# EAGLE design w076o (EAGLE 6.6.0)
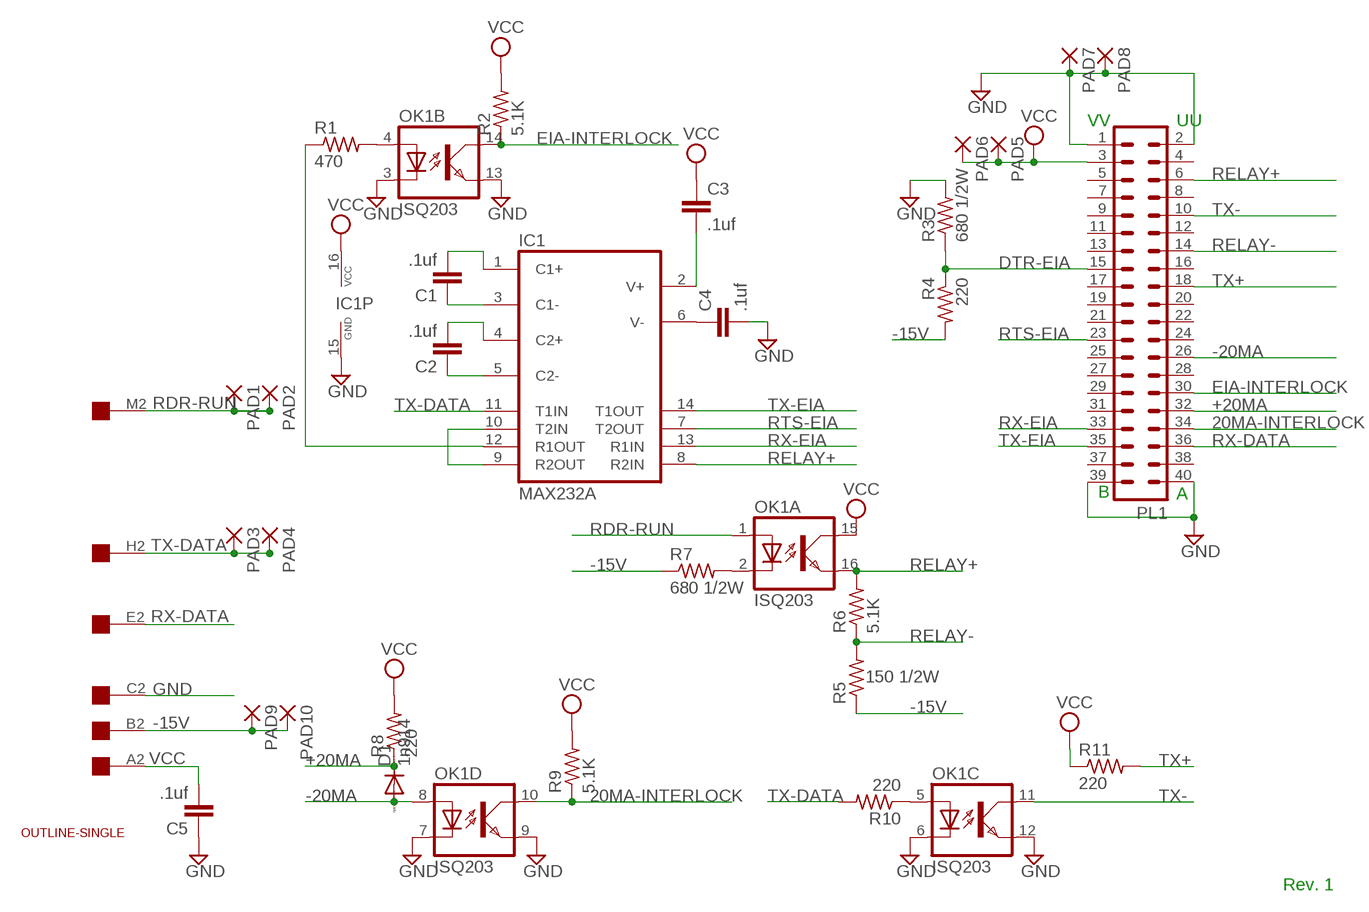
[diagram p0: schematic, sheet 1]

## Parts
C1  .1uf  C-EU050-025X075  [C050-025X075]
C2  .1uf  C-EU050-025X075  [C050-025X075]
C3  .1uf  C-EU050-025X075  [C050-025X075]
C4  .1uf  C-EU050-025X075  [C050-025X075]
C5  .1uf  C-EU050-025X075  [C050-025X075]
D1  1n914  1N4004  [DO41-10]
IC1  MAX232A  MAX232  [DIL16]
OK1  ISQ203  ILQ1  [DIL16]
PAD1  1,6/0,8  [1,6/0,8]
PAD2  1,6/0,8  [1,6/0,8]
PAD3  1,6/0,8  [1,6/0,8]
PAD4  1,6/0,8  [1,6/0,8]
PAD5  1,6/0,8  [1,6/0,8]
PAD6  1,6/0,8  [1,6/0,8]
PAD7  1,6/0,8  [1,6/0,8]
PAD8  1,6/0,8  [1,6/0,8]
PAD9  1,6/0,8  [1,6/0,8]
PAD10  1,6/0,8  [1,6/0,8]
PL1  40H  [40H]
R1  470  R-US_0207/10  [0207/10]
R2  5.1K  R-US_0207/10  [0207/10]
R3  680 1/2W  R-US_0207/12  [0207/12]
R4  220  R-US_0207/10  [0207/10]
R5  150 1/2W  R-US_0207/12  [0207/12]
R6  5.1K  R-US_0207/10  [0207/10]
R7  680 1/2W  R-US_0207/12  [0207/12]
R8  220  R-US_0207/10  [0207/10]
R9  5.1K  R-US_0207/10  [0207/10]
R10  220  R-US_0207/10  [0207/10]
R11  220  R-US_0207/10  [0207/10]
U$1  EDGE-2CONNECTOR  [EDGE-CON2]
U$2  OUTLINE-SINGLE  [SINGLE]

## Nets
20MA-INTERLOCK: OK1.10(D:COL) PL1.34 R9.1
+20MA: D1.C PL1.32 R8.1
-15V [supply]: PAD9.1(P) PAD10.1(P) R4.2 R5.1 R7.1 U$1.B2
-20MA: D1.A OK1.8(D:A) PL1.26
DTR-EIA: PL1.15 R3.1 R4.1
EIA-INTERLOCK: OK1.14(B:COL) PL1.30 R2.1
GND [supply]: C4.2 C5.1 IC1.15(GND) OK1.3(B:C) OK1.6(C:C) OK1.7(D:C) OK1.9(D:EMIT) OK1.12(C:EMIT) OK1.13(B:EMIT) PAD7.1(P) PAD8.1(P) PL1.1 PL1.2 PL1.39 PL1.40 R3.2 U$1.C2
N$1: C2.1 IC1.5(C2-)
N$2: C2.2 IC1.4(C2+)
N$3: C1.2 IC1.1(C1+)
N$4: C1.1 IC1.3(C1-)
N$5: OK1.2(A:C) R7.2
N$6: IC1.9(R2OUT) IC1.10(T2IN)
N$8: IC1.12(R1OUT) R1.1
N$9: C3.2 IC1.2(V+)
N$10: C4.1 IC1.6(V-)
N$11: OK1.4(B:A) R1.2
N$15: OK1.5(C:A) R10.1
RDR-RUN: OK1.1(A:A) PAD1.1(P) PAD2.1(P) U$1.M2
RELAY+: IC1.8(R2IN) OK1.16(A:EMIT) PL1.6 R6.2
RELAY-: PL1.14 R5.2 R6.1
RTS-EIA: IC1.7(T2OUT) PL1.23
RX-DATA: PL1.36 U$1.E2
RX-EIA: IC1.13(R1IN) PL1.33
TX+: PL1.18 R11.2
TX-: OK1.11(C:COL) PL1.10
TX-DATA: IC1.11(T1IN) PAD3.1(P) PAD4.1(P) R10.2 U$1.H2
TX-EIA: IC1.14(T1OUT) PL1.35
VCC [supply]: C3.1 C5.2 IC1.16(VCC) OK1.15(A:COL) PAD5.1(P) PAD6.1(P) PL1.3 R2.2 R8.2 R9.2 R11.1 U$1.A2
Unconnected: PL1.4 PL1.5 PL1.7 PL1.8 PL1.9 PL1.11 PL1.12 PL1.13 PL1.16 PL1.17 PL1.19 PL1.20 PL1.21 PL1.22 PL1.24 PL1.25 PL1.27 PL1.28 PL1.29 PL1.31 PL1.37 PL1.38 U$1.A1 U$1.B1 U$1.C1 U$1.D1 U$1.D2 U$1.E1 U$1.F1 U$1.F2 U$1.H1 U$1.J1 U$1.J2 U$1.K1 U$1.K2 U$1.L1 U$1.L2 U$1.M1 U$1.N1 U$1.N2 U$1.P1 U$1.P2 U$1.R1 U$1.R2 U$1.S1 U$1.S2 U$1.T1 U$1.T2 U$1.U1 U$1.U2 U$1.V1 U$1.V2

## Notes on the sheet
- VV | UU
- B | A
- Rev. 1

## Library data of the parts
C1-C5 = rcl:C-EU: CAPACITOR, European symbol
D1 = diode:1N4004: DIODE general purpose rectifier, 1 A
IC1 = maxim:MAX232: RS232 TRANSCEIVER; MF: MAXIM; MPN: MAX232ACPE+; OC_FARNELL: 9723773; OC_NEWARK: 68K4544
OK1 = optocoupler:ILQ1: SIEMENS OPTO COUPLER; MF: VISHAY/TELEFUNKEN; MPN: ILQ1; OC_FARNELL: 1469501; OC_NEWARK: 88K1954
PAD1-PAD10 = wirepad:1,6/0,8: THROUGH-HOLE PAD
PL1 = con-harting-h:40H: CONNECTOR; OC_FARNELL: unknown; OC_NEWARK: unknown
R1-R11 = rcl:R-US_: RESISTOR, American symbol
U$1 = dec-con:EDGE-2: Double-Sided DEC edge connector.
U$2 = dec-con:OUTLINE-*: Board outlines for DEC boards.

## Net classes
1 supply: width 0.508 mm

## Board
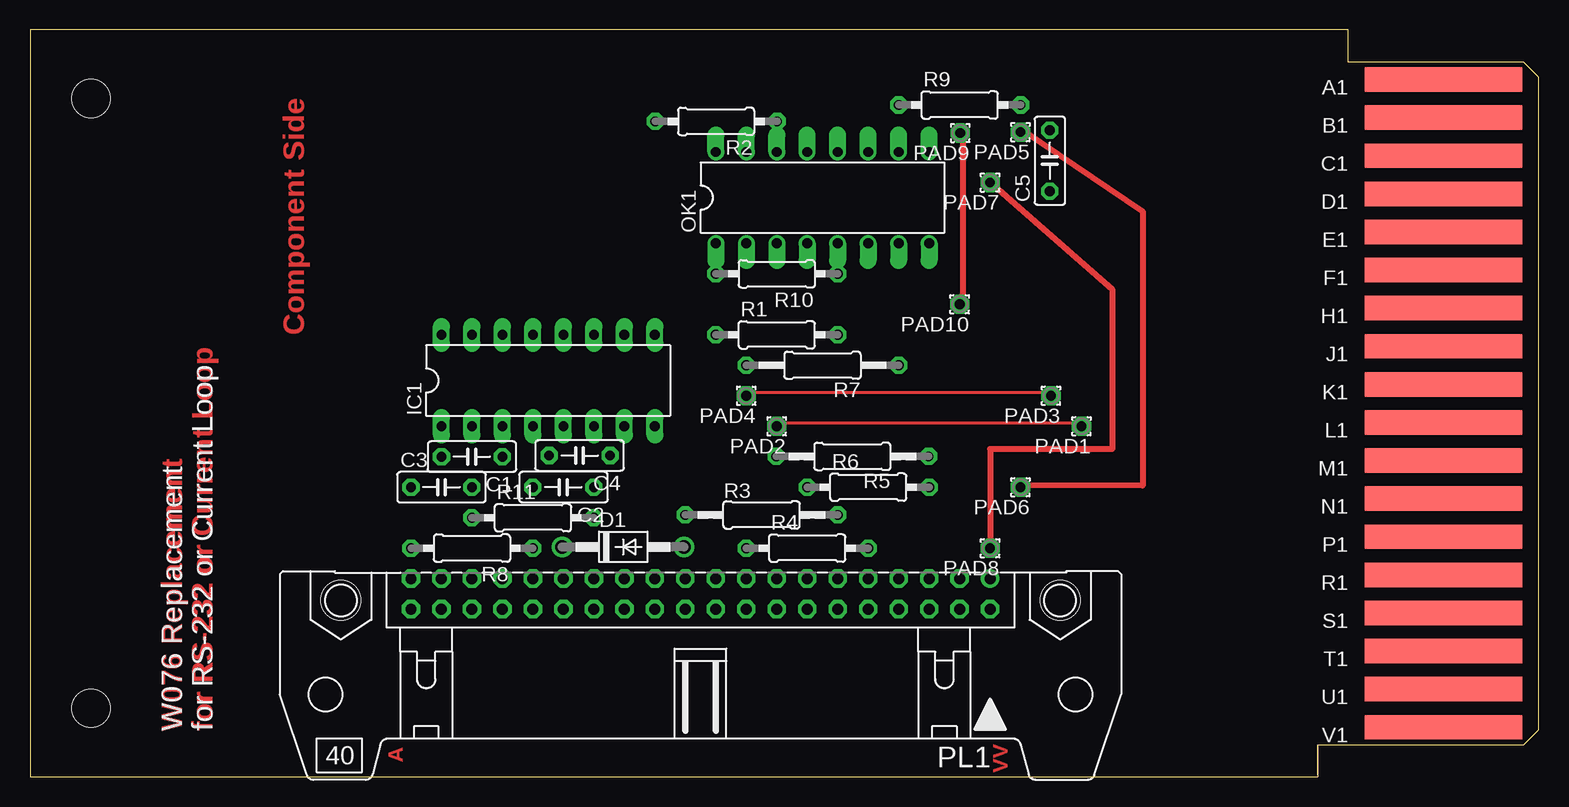
[diagram p1: board, top side]
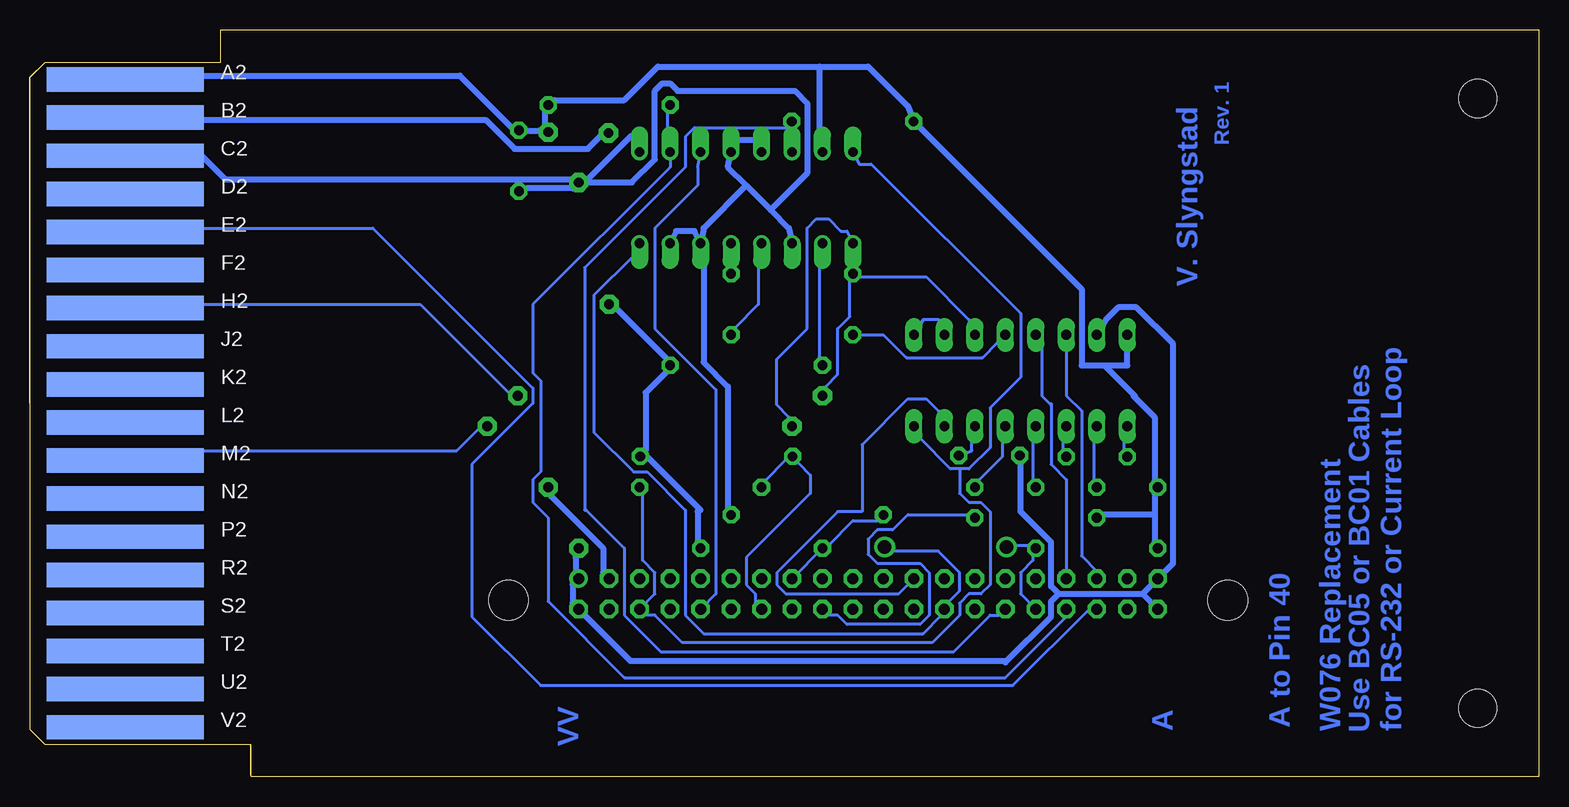
[diagram p2: board, bottom side, seen from below]

Size 125.73 x 62.23 mm. Coordinates in mm from the lower left corner, seen from the top.
Copper layers (1*16): Top 0.035mm / dielectric 1.5mm / Bottom 0.035mm
Design rules "10mils *": minimum track width 10mil, minimum drill 28mil, track to track 15mil, track to pad 10mil, pad to pad 10mil, via to via 10mil, smd to smd 10mil, copper to edge 15mil, drill to drill 10mil, minimum pad ring 12mil, minimum via ring 8mil, stop-mask expansion 0mil, vias tented up to drill 0mil, thermal gap 10mil

### Footprints (pad centres in the part's own frame; a part is rotated, then mirrored left to right if it is on the bottom)
C050-025X075 = drill 0.813 octagon: 1 -2.54,0; 2 2.54,0
DO41-10 = drill 1.118: A 5.08,0; C -5.08,0
DIL16 = drill 0.813 long: 1 -8.89,-3.81; 2 -6.35,-3.81; 3 -3.81,-3.81; 4 -1.27,-3.81; 5 1.27,-3.81; 6 3.81,-3.81; 7 6.35,-3.81; 8 8.89,-3.81; 9 8.89,3.81; 10 6.35,3.81; 11 3.81,3.81; 12 1.27,3.81; 13 -1.27,3.81; 14 -3.81,3.81; 15 -6.35,3.81; 16 -8.89,3.81
DIL16' = drill 0.813 offset: 1 -8.89,-3.81; 2 -6.35,-3.81; 3 -3.81,-3.81; 4 -1.27,-3.81; 5 1.27,-3.81; 6 3.81,-3.81; 7 6.35,-3.81; 8 8.89,-3.81; 9 8.89,3.81; 10 6.35,3.81; 11 3.81,3.81; 12 1.27,3.81; 13 -1.27,3.81; 14 -3.81,3.81; 15 -6.35,3.81; 16 -8.89,3.81
1,6/0,8 = drill 0.813 pad 1.6 octagon: 1 0,0
40H = drill 0.914: 1 -24.13,-1.27 | drill 0.914 octagon: 2 -24.13,1.27; 3 -21.59,-1.27; 4 -21.59,1.27; 5 -19.05,-1.27; 6 -19.05,1.27; 7 -16.51,-1.27; 8 -16.51,1.27; 9 -13.97,-1.27; 10 -13.97,1.27; 11 -11.43,-1.27; 12 -11.43,1.27; 13 -8.89,-1.27; 14 -8.89,1.27; 15 -6.35,-1.27; 16 -6.35,1.27; 17 -3.81,-1.27; 18 -3.81,1.27; 19 -1.27,-1.27; 20 -1.27,1.27; 21 1.27,-1.27; 22 1.27,1.27; 23 3.81,-1.27; 24 3.81,1.27; 25 6.35,-1.27; 26 6.35,1.27; 27 8.89,-1.27; 28 8.89,1.27; 29 11.43,-1.27; 30 11.43,1.27; 31 13.97,-1.27; 32 13.97,1.27; 33 16.51,-1.27; 34 16.51,1.27; 35 19.05,-1.27; 36 19.05,1.27; 37 21.59,-1.27; 38 21.59,1.27; 39 24.13,-1.27; 40 24.13,1.27 | hole 3.302: -29.972,0.533; 29.972,0.533
0207/10 = drill 0.813 octagon: 1 -5.08,0; 2 5.08,0
0207/12 = drill 0.813 octagon: 1 -6.35,0; 2 6.35,0
EDGE-CON2 = smd 13.106 x 2.032: A1 7.938,4.128; B1 7.938,7.303; C1 7.938,10.477; D1 7.938,13.652; E1 7.938,16.828; F1 7.938,20.003; H1 7.938,23.177; J1 7.938,26.352; K1 7.938,29.527; L1 7.938,32.703; M1 7.938,35.877; N1 7.938,39.053; P1 7.938,42.227; R1 7.938,45.403; S1 7.938,48.578; T1 7.938,51.752; U1 7.938,54.928; V1 7.938,58.102 | smd 13.106 x 2.032 bottom: A2 7.938,4.128; B2 7.938,7.303; C2 7.938,10.477; D2 7.938,13.652; E2 7.938,16.828; F2 7.938,20.003; H2 7.938,23.177; J2 7.938,26.352; K2 7.938,29.527; L2 7.938,32.703; M2 7.938,35.877; N2 7.938,39.053; P2 7.938,42.227; R2 7.938,45.403; S2 7.938,48.578; T2 7.938,51.752; U2 7.938,54.928; V2 7.938,58.102
SINGLE = hole 3.175: 120.65,56.515; 120.65,5.715

### Placement (x,y rotation side)
C1  36.83,26.67 180 top
C2  44.45,24.13 180 top
C3  34.29,24.13 0 top
C4  45.8,26.77 180 top
C5  84.99,51.33 90 top
D1  49.43,19.15 0 top
IC1  43.18,33.02 0 top
OK1  ISQ203  [DIL16']  66.04,48.26 0 top
PAD1  87.63,29.21 180 top
PAD2  62.23,29.21 180 top
PAD3  85.09,31.75 180 top
PAD4  59.69,31.75 180 top
PAD5  82.55,53.72 180 top
PAD6  82.55,24.13 180 top
PAD7  80.01,49.53 180 top
PAD8  80.01,19.05 180 top
PAD9  77.52,53.64 180 top
PAD10  77.47,39.37 180 top
PL1  55.88,15.24 180 top
R1  62.23,36.83 0 top
R2  57.18,54.61 180 top
R3  60.96,21.82 0 top
R4  64.77,19.05 0 top
R5  68.53,26.7 180 top
R6  69.85,24.13 0 top
R7  66.04,34.29 180 top
R8  36.83,19.05 180 top
R9  77.47,55.98 0 top
R10  62.23,41.91 180 top
R11  41.91,21.59 0 top
U$1  125.73,62.23 180 top
U$2  125.73,62.23 180 top

### Tracks (layer width: path | path; a pad name or v marks a point on that pad's centre or on a via)
20MA-INTERLOCK
  Bottom 0.254: R9.1 72.64,55.37 72.64,53.34 OK1.10 72.39,50.8 83.82,39.37 83.82,33.66 83.19,33.02 83.19,25.4 83.82,24.77 83.82,22.86 82.55,21.59 82.55,14.61 76.2,8.26 44.45,8.26 39.37,13.34 PL1.34
+20MA
  Bottom 0.254: PL1.32 43.18,15.24 43.18,17.02 42.16,18.03 42.16,18.54 R8.1 42.42,19.3 43.69,19.3 D1.C
-15V
  Top 0.508: PAD9.1 77.72,53.85 77.72,40.13 PAD10.1
  Bottom 0.508: PAD10.1 76.96,39.12 72.64,34.8 R7.1 72.64,33.78 74.42,32 74.42,27.18 R5.1 74.3,26.67 69.85,22.23 70.1,22.1 70.1,19.56 R4.2 | U$1.B2 112.39,54.74 87.76,54.74 85.34,52.32 79.25,52.32 78.23,53.34 PAD9.1
-20MA
  Bottom 0.254: OK1.8 75.44,43.43 78.74,40.13 78.74,28.7 75.44,25.4 74.42,25.4 74.3,25.4 71.12,22.23 71.12,22.1 71.12,13.46 69.6,11.94 51.31,11.94 49.78,13.46 PL1.26 49.28,14.48 48.26,15.49 48.26,17.02 50.04,18.8 53.85,18.8 D1.A
DTR-EIA
  Bottom 0.254: PL1.15 R4.1 59.18,19.3 57.15,21.34 55.12,21.34 R3.1
EIA-INTERLOCK
  Bottom 0.254: 62.48,54.1 62.48,53.34 OK1.14 | 62.48,54.1 70.36,54.1 71.12,53.34 71.12,50.8 79.5,42.42 79.5,22.23 79.38,22.23 76.2,19.05 76.2,18.41 76.2,18.29 76.2,13.46 73.15,10.41 48.77,10.41 45.72,13.46 44.96,13.46 PL1.30 | R2.1 62.23,53.98 62.48,54.1
GND
  Top 0.508: PAD8.1 80.01,27.3 90.17,27.3 90.17,40.64 PAD7.1
  Bottom 0.508: OK1.13 65.28,53.09 66.8,53.09 OK1.12 67.56,50.8 66.04,49.28 | PAD8.1 80.26,18.29 80.26,17.02 PL1.1 80.52,16 80.52,14.48 PL1.2 75.69,9.65 44.45,9.65 44.45,9.53 40.64,13.34 40.64,14.61 40.01,15.24 | OK1.7 71.88,45.47 70.36,45.47 OK1.6 | 64.01,47.24 66.04,49.28 | 64.01,47.24 62.48,45.72 OK1.3 | 66.04,49.28 69.6,45.72 OK1.6 | OK1.6 69.6,43.18 69.6,34.54 67.56,32.51 67.56,22.35 R3.2 | 64.01,47.24 60.96,50.29 60.96,56.13 61.98,57.15 71.75,57.15 72.39,57.78 73.03,57.78 73.66,57.15 73.66,51.44 75.56,49.53 PAD7.1 | IC1.15 36.07,38.1 35.05,39.12 33.53,39.12 30.48,36.07 30.48,17.78 PL1.39 33.02,15.24 | 40.01,15.24 33.02,15.24 | 33.02,15.24 PL1.40 | C4.2 43.18,26.16 43.18,22.1 40.64,19.56 40.64,15.88 40.01,15.24 | PAD7.1 79.25,49.78 75.63,53.4 75.56,53.34 74.93,53.34 OK1.9 | C5.1 84.33,49.02 80.52,49.02 PAD7.1 | PAD7.1 80.77,49.78 109.47,49.78 111.76,52.07 U$1.C2
N$1
  Bottom 0.254: IC1.5 44.7,28.19 44.7,26.67 46.74,24.64 C2.1
N$2
  Bottom 0.254: IC1.4 42.16,28.19 42.16,24.64 C2.2
N$3
  Bottom 0.254: IC1.1 34.54,28.19 34.54,27.18 C1.2
N$4
  Bottom 0.254: IC1.3 39.62,28.19 39.62,27.18 C1.1
N$5
  Bottom 0.254: OK1.2 59.94,43.18 59.94,34.8 R7.2
N$6
  Bottom 0.254: IC1.9 51.31,38.1 50.04,38.1 IC1.10
N$8
  Bottom 0.254: 56.64,36.58 R1.1 56.52,36.83 54.61,36.83 52.7,34.92 46.35,34.92 45.09,36.2 IC1.12
N$9
  Bottom 0.254: IC1.2 37.08,28.19 37.08,24.64 C3.2
N$10
  Bottom 0.254: IC1.6 47.24,28.19 47.24,27.18 C4.1
N$11
  Bottom 0.254: OK1.4 65.02,43.18 65.02,39.37 67.06,37.34 R1.2
N$15
  Bottom 0.254: OK1.5 67.56,43.18 67.56,42.42 R10.1
RDR-RUN
  Top 0.254: PAD1.1 86.87,29.46 62.99,29.46 PAD2.1
  Bottom 0.254: OK1.1 57.66,45.47 58.17,45.47 59.18,46.48 60.2,46.48 60.96,45.72 60.96,37.34 63.5,34.8 63.5,30.99 62.48,29.97 PAD2.1 | U$1.M2 111.76,27.18 90.17,27.18 88.39,28.96 PAD1.1
RELAY+
  Bottom 0.254: R6.2 74.68,23.62 74.68,18.03 73.66,17.02 73.66,15.24 PL1.6 74.42,13.46 73.66,13.46 71.37,11.18 50.55,11.18 48.26,13.46 48.26,14.48 47.5,15.24 46.48,15.24 45.72,16 45.72,22.1 46.48,22.86 47.5,22.86 48.26,23.62 48.26,25.65 | 48.26,25.65 49.02,25.65 51.56,28.19 IC1.8 | 48.26,25.65 47.5,25.65 45.72,27.43 45.72,30.73 43.18,33.27 43.18,38.61 55.63,51.05 56.64,51.05 OK1.16
RELAY-
  Bottom 0.254: R6.1 64.52,24.64 62.74,26.42 R5.2 61.72,26.16 60.71,25.15 60.71,23.62 66.04,18.29 66.04,16 65.28,15.24 65.28,14.48 PL1.14
RTS-EIA
  Bottom 0.254: PL1.23 53.34,15.24 62.74,15.24 63.5,16 63.5,17.02 58.42,22.1 56.39,22.1 56.39,27.69 52.58,31.5 51.05,31.5 50.04,30.48 IC1.7
RX-DATA
  Bottom 0.254: PL1.36 37.47,13.97 43.81,7.62 83.19,7.62 88.9,13.34 88.9,26.04 83.82,31.11 83.82,32.38 97.16,45.72 111.76,45.72 U$1.E2
RX-EIA
  Bottom 0.254: 40.7,31.05 41.4,31.75 41.4,35.81 IC1.13 | 40.7,31.05 40.64,30.99 | 39.88,17.02 PL1.33 39.37,17.14 39.37,24.77 40.64,26.04 40.64,31.11 40.7,31.05
TX+
  Bottom 0.254: R11.2 47.5,21.84 52.58,21.84 53.85,20.57 55.12,20.57 55.88,19.81 55.88,18.54 55.12,17.78 51.56,17.78 50.8,17.02 50.8,13.46 51.56,12.7 57.66,12.7 58.42,13.46 59.18,13.46 PL1.18
TX-
  Bottom 0.254: OK1.11 70.1,50.8 70.1,49.28 73.66,45.72 73.66,37.34 68.58,32.26 68.58,15.24 PL1.10
TX-DATA
  Top 0.254: PAD4.1 60.45,32 84.33,32 PAD3.1
  Bottom 0.254: IC1.11 47.5,38.1 51.05,41.66 56.64,41.66 R10.2 57.4,41.4 57.4,38.35 58.42,37.34 58.42,33.53 59.44,32.51 PAD4.1 | U$1.H2 113.03,39.37 93.22,39.37 85.85,32 PAD3.1
TX-EIA
  Bottom 0.254: IC1.14 39.37,35.56 39.37,31.75 38.1,30.48 38.1,18.41 36.83,17.14 PL1.35
VCC
  Top 0.508: PAD6.1 82.55,24.16 83.13,24.28 92.71,24.26 92.71,47.12 82.8,53.85 PAD5.1
  Bottom 0.508: PL1.3 77.98,17.02 77.98,19.05 82.3,23.37 PAD6.1 | 32,21.84 32,23.62 C3.1 32,24.64 32,29.97 33.72,31.69 | 32,21.84 32,19.56 R8.2 | 59.94,59.18 73.41,59.18 76.2,56.39 82.04,56.39 R9.2 82.8,55.37 82.8,54.36 PAD5.1 83.31,53.85 84.33,53.85 C5.2 85.6,54.1 89.92,58.42 113.03,58.42 U$1.A2 | 59.94,59.18 55.88,59.18 52.58,55.88 R2.2 38.1,40.64 38.1,34.29 36.2,34.29 | 59.94,59.18 59.94,53.34 OK1.15 | 33.72,31.69 33.78,31.75 | 32,21.84 36.32,21.84 R11.1 | IC1.16 34.29,34.29 36.2,34.29 | 36.2,34.29 33.66,31.75 33.72,31.69

### Text on the board
Top: Component Side | W076 Replacement | for RS-232 or Current Loop | A | VV
Bottom: Rev. 1 | V. Slyngstad | for RS-232 or Current Loop | Use BC05 or BC01 Cables | W076 Replacement | A to Pin 40 | A | VV
tPlace: W076 Replacement | for RS-232 or Current Loop
_tplace: .1uf